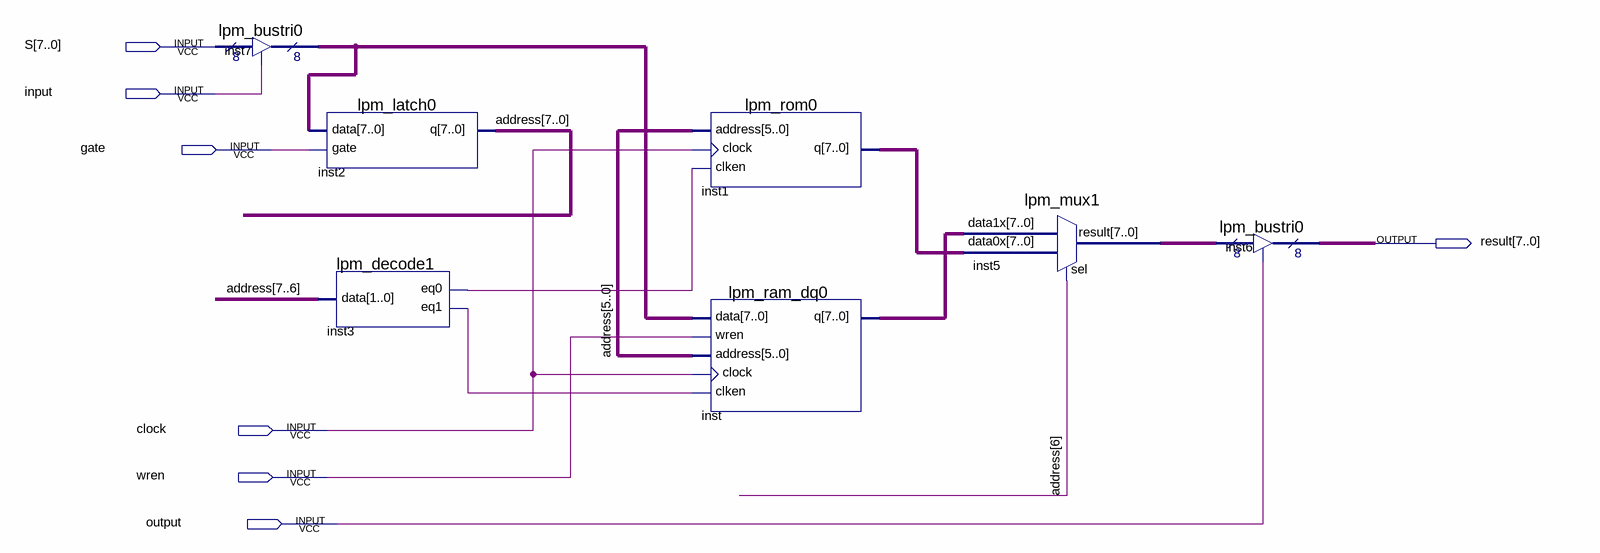
[diagram p0: schematic sheet]
// Quartus schematic shiyan03.bdf as structural Verilog: 7 symbols, 7 pins
module shiyan03 (
  input  [7:0] S,
  input  \input ,
  input  gate,
  input  clock,
  input  wren,
  input  \output ,
  output [7:0] result
);

  wire inst3_eq0, inst3_eq1;
  wire [7:0] address, inst1_q, inst5_result, inst7_tridata, inst_q;

  lpm_bustri0 inst7 (.enabledt(\input ), .data(S), .tridata(inst7_tridata));
  lpm_latch0 inst2 (.data(inst7_tridata), .gate(gate), .q(address));
  lpm_decode1 inst3 (.data(address[7:6]), .eq0(inst3_eq0), .eq1(inst3_eq1));
  lpm_rom0 inst1 (.address(address[5:0]), .clock(clock), .clken(inst3_eq0), .q(inst1_q));
  lpm_ram_dq0 inst (
    .data(inst7_tridata), .wren(wren), .address(address[5:0]), .clock(clock), .clken(inst3_eq1), .q(inst_q));
  lpm_mux1 inst5 (.data1x(inst_q), .data0x(inst1_q), .sel(address[6]), .result(inst5_result));
  lpm_bustri0 inst6 (.enabledt(\output ), .data(inst5_result), .tridata(result));
endmodule
